# EAGLE design wiringshield1 (EAGLE 5.11)
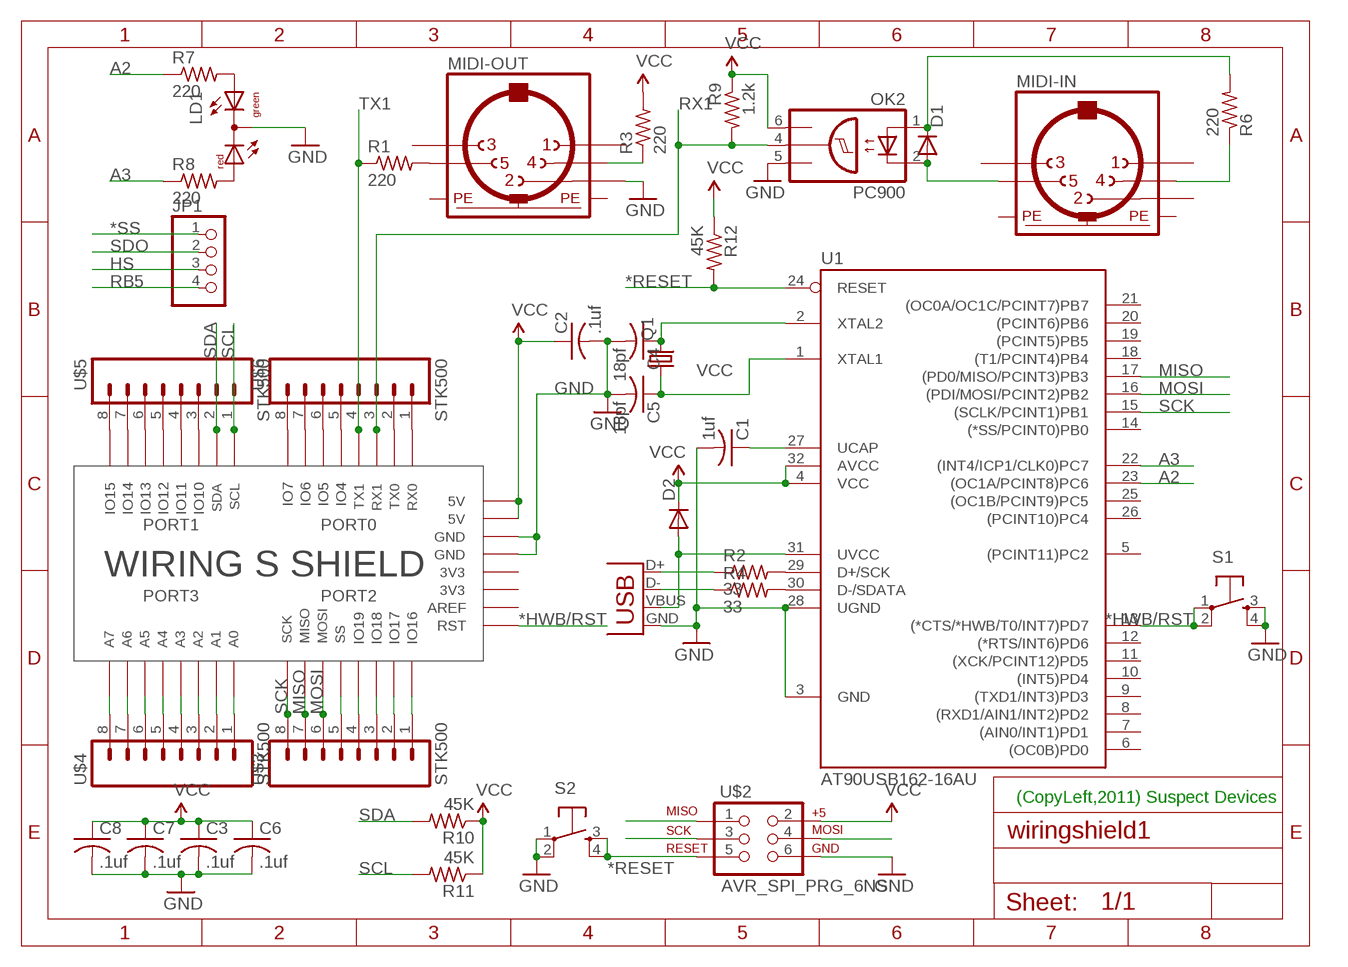
[diagram p0: schematic, sheet 1]

## Parts
C1  1uf  C-USC0603  [C0603]
C2  .1uf  C-USC0603  [C0603]
C3  .1uf  C-USC0603  [C0603]
C4  18pf  C-USC0603  [C0603]
C5  18pf  C-USC0603  [C0603]
C6  .1uf  C-USC0603  [C0603]
C7  .1uf  C-USC0603  [C0603]
C8  .1uf  C-USC0603  [C0603]
D1  DIODEPTH2  [DOIDE-1N4148]
D2  DIODEPTH2  [DOIDE-1N4148]
JP1  PINHD-1X4  [1X04]
LD1  DUOLED-RG-C  [DUOLED-C-5MM]
MIDI-IN  MAB5SH  [MAB5SH]
MIDI-OUT  MAB5SH  [MAB5SH]
OK2  PC900  OPI8013  [DIL06]
Q1  CRYSTALHC49S  [HC49/S]
R1  220  R-US_R0603  [R0603]
R2  33  R-US_R0603  [R0603]
R3  220  R-US_R0603  [R0603]
R4  33  R-US_R0603  [R0603]
R6  220  R-US_R0603  [R0603]
R7  220  R-US_R0603  [R0603]
R8  220  R-US_R0603  [R0603]
R9  1.2k  R-US_R0603  [R0603]
R10  45K  R-US_R0603  [R0603]
R11  45K  R-US_R0603  [R0603]
R12  45K  R-US_R0603  [R0603]
S1  TAC_SWITCHPTH  [TACTILE-PTH]
S2  TAC_SWITCHPTH  [TACTILE-PTH]
U1  AT90USB162-16AU  [VQFP32]
U$1  WIRINGSHIELD  [WIRINGSHIELD]
U$2  AVR_SPI_PRG_6NS  [2X3-NS]
U$3  STK500  [2X5-SHROUDED]
U$4  STK500  [2X5-SHROUDED]
U$5  STK500  [2X5-SHROUDED]
U$6  STK500  [2X5-SHROUDED]
X3  USB-3DPTH  [USB-B-PTH]

## Nets
*HWB/RST: S1.1 S1.2 U1.13((*CTS/*HWB/T0/INT7)PD7) U$1.P$40(RST)
*RESET: R12.2 S2.3 S2.4 U1.24(RESET) U$2.5
*SS: JP1.1
A2: R7.1 U1.23((OC1A/PCINT8)PC6)
A3: R8.1 U1.22((INT4/ICP1/CLK0)PC7)
GND [vcc]: C1.2 C2.2 C3.2 C4.2 C5.2 C6.2 C7.2 C8.2 LD1.C MIDI-OUT.2 OK2.5(GND) S1.3 S1.4 S2.1 S2.2 U1.3(GND) U1.28(UGND) U$1.P$35(GND) U$1.P$36(GND) U$2.6 X3.GND
HS: JP1.3
MISO: U1.17((PD0/MISO/PCINT3)PB3) U$1.P$23(IO22) U$2.1 U$3.7
MOSI: U1.16((PDI/MOSI/PCINT2)PB2) U$1.P$22(IO21) U$2.4 U$3.6
N$1: MIDI-OUT.5 R1.2
N$2: MIDI-OUT.4 R3.1
N$3: C1.1 U1.27(UCAP)
N$4: U$1.P$17(IO16) U$3.1
N$5: U$1.P$18(IO17) U$3.2
N$6: LD1.AX(AG) R7.2
N$7: R2.1 X3.D+
N$8: R4.1 X3.D-
N$9: D2.A U1.31(UVCC) X3.VBUS
N$10: D1.C OK2.1(A) R6.2
N$11: U$1.P$19(IO18) U$3.3
N$12: U$1.P$20(IO19) U$3.4
N$13: U$1.P$21(IO20) U$3.5
N$14: C4.1 Q1.2 U1.2(XTAL2)
N$16: MIDI-IN.4 R6.1
N$17: D1.A MIDI-IN.5 OK2.2(C)
N$18: C5.1 Q1.1 U1.1(XTAL1)
N$22: U$1.P$25(IO24) U$4.1
N$23: U$1.P$26(IO25) U$4.2
N$24: U$1.P$27(IO26) U$4.3
N$25: U$1.P$28(IO27) U$4.4
N$26: U$1.P$29(IO28) U$4.5
N$27: U$1.P$30(IO29) U$4.6
N$28: U$1.P$31(IO30) U$4.7
N$29: U$1.P$32(IO31) U$4.8
N$30: LD1.AR R8.2
N$31: U$1.P$11(IO10) U$5.3
N$32: U$1.P$12(IO11) U$5.4
N$33: U$1.P$13(IO12) U$5.5
N$34: U$1.P$14(IO13) U$5.6
N$35: U$1.P$15(IO14) U$5.7
N$36: U$1.P$16(IO15) U$5.8
N$37: U$1.P$1(IO0) U$6.1
N$38: U$1.P$2(IO1) U$6.2
N$39: U$1.P$5(IO4) U$6.5
N$40: U$1.P$6(IO5) U$6.6
N$41: U$1.P$7(IO6) U$6.7
N$42: U$1.P$8(IO7) U$6.8
N$45: R2.2 U1.29(D+/SCK)
N$47: R4.2 U1.30(D-/SDATA)
RB5: JP1.4
RX1: OK2.4(OUT) R9.2 U$1.P$3(IO2) U$6.3
SCK: U1.15((SCLK/PCINT1)PB1) U$1.P$24(IO23) U$2.3 U$3.8
SCL: R11.2 U$1.P$9(IO8) U$5.1
SDA: R10.2 U$1.P$10(IO9) U$5.2
SDO: JP1.2
TX1: R1.1 U$1.P$4(IO3) U$6.4
VCC: C2.1 C3.1 C6.1 C7.1 C8.1 D2.C OK2.6(VCC) R3.2 R9.1 R10.1 R11.1 R12.1 U1.4(VCC) U1.32(AVCC) U$1.P$33(5V) U$1.P$34(5V) U$2.2
Unconnected: MIDI-IN.1 MIDI-IN.2 MIDI-IN.3 MIDI-IN.PE MIDI-IN.PE@(PE) MIDI-OUT.1 MIDI-OUT.3 MIDI-OUT.PE MIDI-OUT.PE@(PE) U1.5((PCINT11)PC2) U1.6((OC0B)PD0) U1.7((AIN0/INT1)PD1) U1.8((RXD1/AIN1/INT2)PD2) U1.9((TXD1/INT3)PD3) U1.10((INT5)PD4) U1.11((XCK/PCINT12)PD5) U1.12((*RTS/INT6)PD6) U1.14((*SS/PCINT0)PB0) U1.18((T1/PCINT4)PB4) U1.19((PCINT5)PB5) U1.20((PCINT6)PB6) U1.21((OC0A/OC1C/PCINT7)PB7) U1.25((OC1B/PCINT9)PC5) U1.26((PCINT10)PC4) U$1.P$39(AREF)

## Notes on the sheet
- (CopyLeft,2011) Suspect Devices

## Power pins joined to a net without a drawn wire
3V3: U$1.P$37(3V3) U$1.P$38(3V3)
GND: U$3.9(GND) U$4.9(GND) U$5.9(GND) U$6.9(GND)
VCC: U$3.10(VCC) U$4.10(VCC) U$5.10(VCC) U$6.10(VCC)

## Library data of the parts
C1-C8 = rcl:C-US: CAPACITOR, American symbol
D1 D2 = 3d:DIODE: Diode These are standard reverse protection diodes and small signal diodes. SMA package can handle up to about 1A. SOD-323 can handle about 200mA. What the SOD-323 package when ordering, there are some mfgs out there that are 5-pin packages.
JP1 = 3d2011:PINHD-1X4: PIN HEADER
LD1 = led:DUOLED-RG-C: DUO LED 2 colors (red/green), 5 mm, round, common Cathode www.ligitek.com or other producers.
MIDI-IN MIDI-OUT = 3d2010:MAB5SH: Female CONNECTOR 5 pins 90 deg. with shield, horizontal (DIN 41524)
OK2 = optocoupler:OPI8013: OPTO COUPLER; OC_FARNELL: unknown; OC_NEWARK: unknown
Q1 = crystal:CRYSTAL: CRYSTAL; OC_FARNELL: 1667008; OC_NEWARK: unknown
R1 R3 R7 R8 R10-R12 = resistor:R-US_: RESISTOR, American symbol
R2 R4 R6 R9 = rcl:R-US_: RESISTOR, American symbol
S1 S2 = 3d2011:TAC_SWITCH: Momentary Switch Button commonly used for reset or general input. Spark Fun Electronics SKU : COM-00097
U1 = at90usb:AT90USB162
U$1 = 3d2011:WIRINGSHIELD: Wiring S Shield
U$2 = 3d2011:AVR_SPI_PRG_6: AVR ISP 6 Pin This is the reduced ISP connector for AVR programming. Common on Arduino. This footprint will take up less PCB space and can be used with a 10-pin to 6-pin adapter such as SKU: BOB-08508
U$3-U$6 = 3d2011:STK500
X3 = 3d2010:USB-3D: USB Connectors USB-B-PTH is fully proven SKU : PRT-00139 USB-miniB is fully proven SKU : PRT-00587 USB-A-PCB is untested. USB-A-H is throughly reviewed, but untested. Spark Fun Electronics SKU : PRT-00437 USB-B-SMT is throughly reviewed, but untested. Needs silkscreen touching up. USB-A-S has not been used/tested USB-MB-H has not been used/tested

## Net classes
0 default: width 0.203 mm
1 vcc: width 0.254 mm

## Board
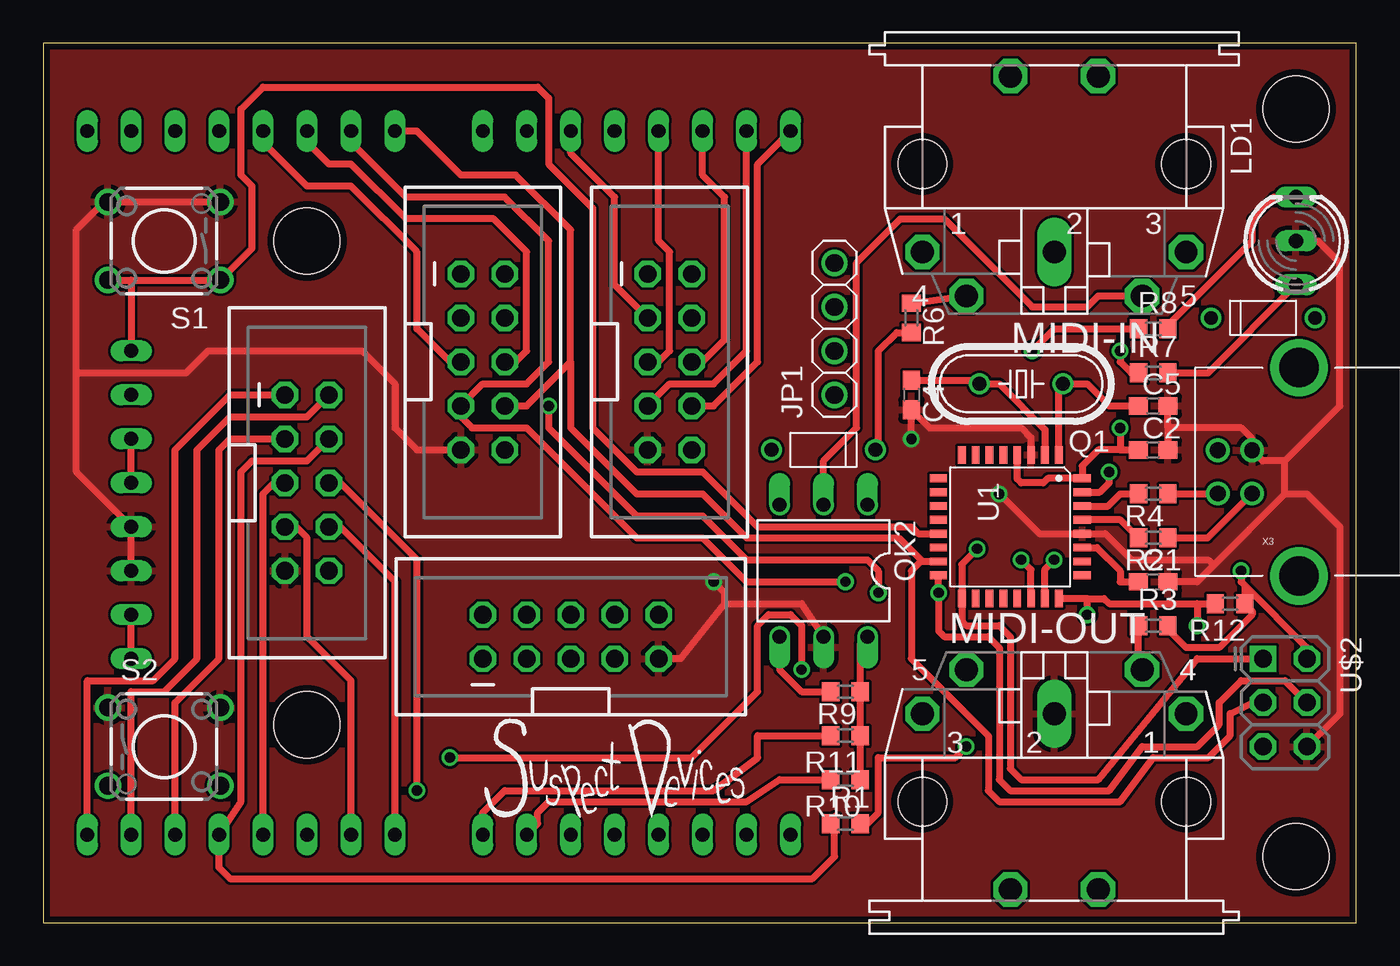
[diagram p1: board, top side]
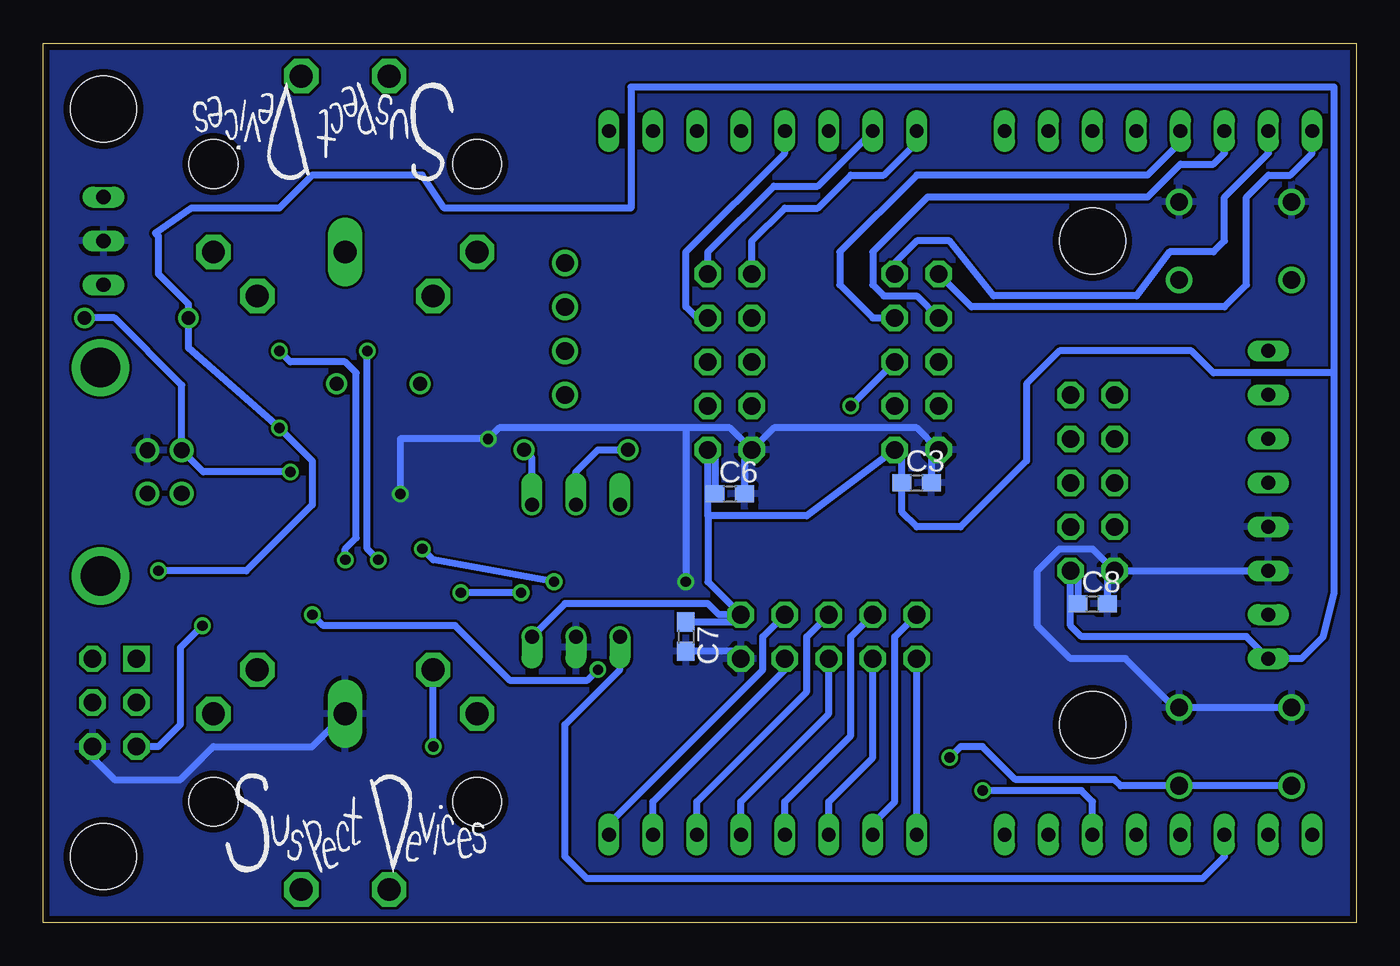
[diagram p2: board, bottom side, seen from below]

Size 75.87 x 50.79 mm. Coordinates in mm from the lower left corner, seen from the top.
Outline: 0,0 75.87,0 75.87,50.79 0,50.79 0,0
Copper layers (1*16): Top 0.0356mm / dielectric 1.5011mm / Bottom 0.0356mm
Design rules "LaenPCBOrder": minimum track width 6mil, minimum drill 13mil, track to track 6mil, track to pad 6mil, pad to pad 6mil, via to via 6mil, smd to smd 6mil, copper to edge 15mil, drill to drill 6mil, minimum pad ring 7mil, minimum via ring 7mil, stop-mask expansion 4mil, vias tented up to drill 0mil, thermal gap 10mil

### Footprints (pad centres in the part's own frame; a part is rotated, then mirrored left to right if it is on the bottom)
C0603 = smd 1.1 x 1: 1 -0.85,0; 2 0.85,0
DOIDE-1N4148 = drill 0.8 round: A 3,0; C -3,0
1X04 = drill 1.016 round: 1 -3.81,0; 2 -1.27,0; 3 1.27,0; 4 3.81,0
DUOLED-C-5MM = drill 0.813 long: AR 2.54,0; AX -2.54,0; C 0,0
MAB5SH = drill 1.321 octagon: 1 7.62,5.08; 3 -7.62,5.08; 4 5.08,7.62; 5 -5.08,7.62; PE -2.54,-5.08; PE@ 2.54,-5.08 | drill 1.321 long: 2 0,5.08 | hole 2.794: 7.62,0; -7.62,0
DIL06 = drill 0.813 offset: 1 -2.54,-3.81; 2 0,-3.81; 3 2.54,-3.81; 4 2.54,3.81; 5 0,3.81; 6 -2.54,3.81
HC49/S = drill 0.813 round: 1 -2.413,0; 2 2.413,0
R0603 = smd 1 x 1.1: 1 -0.85,0; 2 0.85,0
TACTILE-PTH = drill 1.016 round: 1 -3.251,2.261; 2 3.251,2.261; 3 -3.251,-2.261; 4 3.251,-2.261
VQFP32 = smd 1 x 0.45: 1 -4.15,2.8; 2 -4.15,2; 3 -4.15,1.2; 4 -4.15,0.4; 5 -4.15,-0.4; 6 -4.15,-1.2; 7 -4.15,-2; 8 -4.15,-2.8; 17 4.15,-2.8; 18 4.15,-2; 19 4.15,-1.2; 20 4.15,-0.4; 21 4.15,0.4; 22 4.15,1.2; 23 4.15,2; 24 4.15,2.8 | smd 0.45 x 1: 9 -2.8,-4.15; 10 -2,-4.15; 11 -1.2,-4.15; 12 -0.4,-4.15; 13 0.4,-4.15; 14 1.2,-4.15; 15 2,-4.15; 16 2.8,-4.15; 25 2.8,4.15; 26 2,4.15; 27 1.2,4.15; 28 0.4,4.15; 29 -0.4,4.15; 30 -1.2,4.15; 31 -2,4.15; 32 -2.8,4.15
WIRINGSHIELD = drill 0.8 long: P$1 2.54,5.08; P$2 5.08,5.08; P$3 7.62,5.08; P$4 10.16,5.08; P$5 12.7,5.08; P$6 15.24,5.08; P$7 17.78,5.08; P$8 20.32,5.08; P$9 25.4,5.08; P$10 27.94,5.08; P$11 30.48,5.08; P$12 33.02,5.08; P$13 35.56,5.08; P$14 38.1,5.08; P$15 40.64,5.08; P$16 43.18,5.08; P$17 2.54,45.72; P$18 5.08,45.72; P$19 7.62,45.72; P$20 10.16,45.72; P$21 12.7,45.72; P$22 15.24,45.72; P$23 17.78,45.72; P$24 20.32,45.72; P$25 25.4,45.72; P$26 27.94,45.72; P$27 30.48,45.72; P$28 33.02,45.72; P$29 35.56,45.72; P$30 38.1,45.72; P$31 40.64,45.72; P$32 43.18,45.72; P$33 5.08,15.24; P$34 5.08,17.78; P$35 5.08,20.32; P$36 5.08,22.86; P$37 5.08,25.4; P$38 5.08,27.94; P$39 5.08,30.48; P$40 5.08,33.02 | hole 3.81: 15.24,11.43; 15.24,39.37; 72.39,46.99; 72.39,3.81
2X3-NS = drill 1.016 square: 1 -2.54,-1.27 | drill 1.016 octagon: 2 -2.54,1.27; 3 0,-1.27; 4 0,1.27; 5 2.54,-1.27; 6 2.54,1.27
2X5-SHROUDED = drill 1.016 octagon: 1 -1.27,5.08; 2 1.27,5.08; 3 -1.27,2.54; 4 1.27,2.54; 5 -1.27,0; 6 1.27,0; 7 -1.27,-2.54; 8 1.27,-2.54; 9 -1.27,-5.08; 10 1.27,-5.08
USB-B-PTH = drill 0.914 round: D+ 0,1.25; D- 1.981,1.25; GND 0,-1.25; VBUS 1.981,-1.25 | drill 2.286 round: P$1 -2.718,-6.02; P$2 -2.718,6.02

### Placement (x,y rotation side)
C1  64.14,19.68 0 top
C2  64.14,27.3 0 top
C3  25.4,25.4 0 bottom
C4  50.16,30.48 270 top
C5  64.14,29.84 0 top
C6  36.2,24.77 0 bottom
C7  38.73,16.51 270 bottom
C8  15.24,18.41 0 bottom
D1  45.09,27.3 180 top
D2  70.48,34.92 0 top
JP1  45.72,34.29 90 top
LD1  72.39,39.37 90 top
MIDI-IN  58.42,43.81 180 top
MIDI-OUT  58.42,6.99 0 top
OK2  45.09,20.32 180 top
Q1  56.52,31.11 180 top
R1  46.35,5.71 0 top
R2  64.14,22.23 180 top
R3  64.14,17.14 0 top
R4  64.14,24.77 180 top
R6  50.16,34.92 270 top
R7  64.14,31.75 0 top
R8  64.14,34.29 0 top
R9  46.35,13.34 180 top
R10  46.35,8.26 180 top
R11  46.35,10.79 180 top
R12  68.58,18.41 180 top
S1  6.99,39.37 180 top
S2  6.99,10.16 0 top
U1  55.88,22.86 270 top
U$1  0,0 0 top
U$2  71.75,12.7 270 top
U$3  25.4,32.38 0 top
U$4  36.2,32.38 0 top
U$5  30.48,16.51 90 top
U$6  15.24,25.4 0 top
U$7  [SUSDEVLOGOSM]  25.4,6.35 0 top
U$8  [SUSDEVLOGOSM]  65.41,3.17 0 bottom
U$9  [SUSDEVLOGOSM]  52.07,48.26 180 bottom
X3  69.85,26.04 180 top

### Tracks (layer width: path | path; a pad name or v marks a point on that pad's centre or on a via)
3V3
  Top 0.406: U$1.P$37 U$1.P$38
*HWB/RST
  Top 0.406: 5.08,37.11 U$1.P$40 | U1.13 50.56,22.46 50.16,22.86 41.27,22.86 38.1,26.04 34.29,26.04 31.75,28.57 31.75,41.27 29.21,43.81 29.21,47.62 28.57,48.26 12.7,48.26 11.43,46.99 11.43,43.18 12.06,42.55 12.06,38.94 S1.1 5.08,37.11 | S1.2 5.08,37.11
*RESET  (via drill 0.6)
  Top 0.406: v23.5,9.53 37.47,9.53 41.27,13.34 41.27,17.14 41.91,17.78 43.18,17.78 43.81,17.14 v43.81,14.61 | 60.33,18.71 U1.24 | 60.33,18.71 61.3,18.71 61.59,18.41 66.67,18.41 | 66.67,18.41 R12.2 | 66.67,18.41 v66.67,17.14 | v60.33,17.78 60.33,18.71
  Bottom 0.406: S2.3 S2.4 13.61,7.9 13.97,8.26 19.68,8.26 21.59,10.16 22.86,10.16 v23.5,9.53 | U$2.5 69.22,10.16 67.94,11.43 67.94,15.88 v66.67,17.14 | v43.81,14.61 44.45,13.97 48.9,13.97 52.07,17.14 59.69,17.14 v60.33,17.78
A2  (via drill 0.6)
  Top 0.406: U1.23 57.88,20.41 v58.42,20.95 | v62.23,33.02 62.23,32.38 62.87,31.75 R7.1
  Bottom 0.406: v58.42,20.95 58.42,21.59 57.78,22.23 57.78,31.75 58.42,32.38 61.59,32.38 v62.23,33.02
A3  (via drill 0.6)
  Top 0.406: R8.1 58.42,34.29 v57.15,33.02 | U1.22 57.08,20.39 v56.52,20.95
  Bottom 0.406: v57.15,33.02 57.15,21.59 v56.52,20.95
GND  (via drill 0.6)
  Top 0.406: 73.66,39.37 74.93,38.1 74.93,29.84 71.75,26.67 | S1.3 S1.4 3.53,41.63 1.91,40.01 1.91,31.75 | 1.91,31.75 1.91,26.04 U$1.P$36 U$1.P$35 | U$3.9 21.59,27.3 20.32,28.57 20.32,31.11 18.41,33.02 9.53,33.02 8.26,31.75 1.91,31.75 | 39.37,18.41 36.83,15.24 U$5.9 | 39.37,18.41 43.81,18.41 OK2.5 | C1.2 66.67,19.68 67.63,20.64 | 71.75,24.77 71.75,26.67 | 71.75,26.67 70.47,26.67 X3.GND 69.85,27.94 69.22,28.57 64.98,28.57 | 67.63,20.64 67.31,20.95 62.87,20.95 61.36,22.46 U1.28 57.55,22.46 v55.24,24.77 | 64.98,28.57 C2.2 | 64.98,28.57 C5.2 | U1.3 57.08,28.01 56.52,28.57 51.22,28.57 C4.2 v50.16,27.94 | 67.63,20.64 71.75,24.77 | 71.75,24.77 73.03,24.77 74.93,22.86 74.93,12.06 U$2.6 | 39.37,18.41 39.37,19.05 v38.73,19.68
  Bottom 0.406: U$6.9 U$1.P$35 | U$4.9 33.66,28.57 25.4,28.57 U$3.9 24.55,26.89 C3.2 | U$4.9 36.2,28.57 38.73,28.57 | C6.2 35.34,26.89 U$4.9 | C7.2 35.98,15.66 U$5.9 | C8.2 14.39,19.9 U$6.9 | S2.1 S2.2 10.52,12.42 13.34,15.24 16.51,15.24 18.41,17.14 18.41,20.32 17.14,21.59 15.24,21.59 U$6.9 | U$2.6 73.03,9.53 71.75,8.26 67.94,8.26 66.04,10.16 60.33,10.16 MIDI-OUT.2 | v55.24,24.77 55.24,27.94 v50.16,27.94 49.53,28.57 38.73,28.57 | 38.73,28.57 v38.73,19.68
  pour Top: 0,0 76.2,0 76.2,50.8 -1.27,50.8
  pour Bottom: 0,0 76.2,0 76.2,50.8 -1.27,50.8
MISO  (via drill 0.6)
  Top 0.406: U$2.1 66.67,15.24 60.96,8.26 56.52,8.26 55.88,8.89 55.88,16.51 55.24,17.14 53.34,17.14 53.08,17.41 U1.17 53.08,20.7 v53.98,21.59 | U$1.P$23 17.78,45.09 20.95,41.91 26.67,41.91 29.21,39.37 29.21,32.38 27.94,31.11 25.4,31.11 U$3.7 24.13,29.21 24.77,28.57 27.94,28.57 34.29,22.23 38.1,22.23 40.64,19.68 v46.35,19.68
  Bottom 0.406: v46.35,19.68 53.34,20.95 v53.98,21.59
MOSI  (via drill 0.6)
  Top 0.406: U$2.4 71.75,13.97 69.22,13.97 67.94,12.7 67.94,11.43 66.67,10.16 63.5,10.16 61.59,7.62 55.88,7.62 55.24,8.26 55.24,15.88 54.61,16.51 52.07,16.51 51.73,16.85 v51.73,19.05 U1.16 | U$1.P$22 15.24,45.09 16.51,43.81 17.78,43.81 20.95,40.64 26.04,40.64 27.94,38.73 27.94,33.02 27.3,32.38 U$3.6 | v29.21,29.84 29.21,28.57 34.29,23.5 38.1,23.5 40.64,20.95 47.62,20.95 48.26,20.32 v48.26,19.05
  Bottom 0.406: U$3.6 v29.21,29.84 | v48.26,19.05 v51.73,19.05
N$1  (via drill 0.6)
  Top 0.406: R1.2 47.62,5.71 48.26,6.35 48.26,9.53 52.7,9.53 v53.34,10.16
  Bottom 0.406: v53.34,10.16 MIDI-OUT.5
N$2
  Top 0.406: R3.1 63.28,14.82 MIDI-OUT.4
N$3
  Top 0.406: U1.27 60.89,21.66 62.23,20.32 62.23,19.68 C1.1
N$4
  Bottom 0.406: U$1.P$17 2.54,44.45 3.81,43.18 5.08,43.18 6.35,41.91 6.35,36.83 7.62,35.56 22.23,35.56 U$3.1
N$5
  Bottom 0.406: U$1.P$18 5.08,44.45 7.62,41.91 7.62,39.37 8.26,38.73 10.79,38.73 12.7,36.2 20.95,36.2 23.5,39.37 25.4,39.37 26.67,38.1 U$3.2
N$6
  Top 0.406: R7.2 67.31,31.75 LD1.AX
N$7
  Top 0.406: R2.1 67.29,22.23 X3.D+
N$8
  Top 0.406: R4.1 67.85,24.77 X3.D-
N$9  (via drill 0.6)
  Top 0.406: U1.31 61.05,24.86 61.59,25.4 v61.59,26.04
  Bottom 0.406: v61.59,26.04 66.62,26.04 X3.VBUS 67.87,31.04 71.75,34.92 D2.A
N$10
  Top 0.406: R6.2 49.31,34.08 48.26,33.02 48.26,27.48 D1.C
  Bottom 0.406: OK2.1 47.62,26.84 D1.C
N$11
  Bottom 0.406: U$1.P$19 7.62,44.45 8.26,43.81 10.16,43.81 12.06,41.91 24.77,41.91 27.94,38.73 27.94,36.83 27.3,36.2 25.4,36.2 U$3.3
N$12
  Bottom 0.406: U$1.P$20 10.16,45.09 12.06,43.18 25.4,43.18 29.84,38.73 29.84,36.83 27.94,34.92 U$3.4
N$13
  Top 0.406: U$1.P$21 12.7,45.09 15.24,42.55 17.78,42.55 21.59,38.73 21.59,34.29 23.5,32.38 U$3.5
N$14
  Top 0.406: U1.2 57.88,28.48 55.24,31.11 Q1.2 53.89,31.33 C4.1
N$16
  Top 0.406: R6.1 MIDI-IN.4
N$17
  Top 0.406: OK2.2 45.09,26.67 46.99,28.57 46.99,38.1 49.53,40.64 52.07,40.64 57.15,35.56 60.33,35.56 60.96,36.2 MIDI-IN.5
  Bottom 0.406: D1.A 43.81,27.3 45.09,26.04 OK2.2
N$18
  Top 0.406: U1.1 58.68,30.87 Q1.1 60.33,31.11 61.59,29.84 C5.1
N$22
  Bottom 0.406: U$1.P$25 25.4,45.09 27.3,43.18 29.21,43.18 31.11,41.27 33.02,41.27 34.92,39.37 U$4.1
N$23
  Bottom 0.406: U$1.P$26 31.11,42.55 33.66,42.55 37.47,38.73 U$4.2
N$24
  Top 0.406: U$1.P$27 30.48,44.45 33.02,41.91 33.02,36.83 U$4.3
N$25
  Bottom 0.406: U$1.P$28 33.02,44.45 38.73,38.73 38.73,35.56 38.1,34.92 U$4.4
N$26
  Top 0.406: U$1.P$29 35.56,39.37 36.2,38.73 36.2,33.02 35.56,32.38 U$4.5
N$27
  Top 0.406: U$1.P$30 38.1,43.18 39.37,41.91 39.37,33.66 38.1,32.38 U$4.6
N$28
  Top 0.406: U$4.7 36.2,31.11 38.73,31.11 40.64,33.02 U$1.P$31
N$29
  Top 0.406: U$4.8 38.73,29.84 41.27,32.38 41.27,43.81 U$1.P$32
N$30
  Top 0.406: LD1.AR 71.12,41.91 69.85,40.64 69.85,39.37 64.98,34.51 R8.2
N$31
  Bottom 0.406: U$5.3 27.94,9.53 30.48,6.99 U$1.P$11
N$32
  Bottom 0.406: U$5.4 29.21,16.51 29.21,10.79 33.02,6.99 U$1.P$12
N$33
  Bottom 0.406: U$5.5 30.48,12.06 35.56,6.99 U$1.P$13
N$34
  Bottom 0.406: U$5.6 31.75,16.51 31.75,13.34 38.1,6.99 U$1.P$14
N$35
  Bottom 0.406: U$5.7 33.02,14.61 40.64,6.99 U$1.P$15
N$36
  Bottom 0.406: U$5.8 34.29,16.51 34.29,14.61 43.18,5.71 U$1.P$16
N$37
  Top 0.406: U$6.1 10.79,30.48 7.62,27.3 7.62,15.24 6.35,13.97 2.54,13.97 U$1.P$1
N$38
  Top 0.406: U$6.2 15.24,29.21 10.79,29.21 8.89,27.3 8.89,15.24 6.99,13.34 5.08,13.34 U$1.P$2
N$39
  Top 0.406: U$6.5 13.34,25.4 12.7,24.77 U$1.P$5
N$40  (via drill 0.6)
  Top 0.406: U$6.6 17.14,25.4 21.59,20.95 v21.59,7.62
  Bottom 0.406: v21.59,7.62 15.88,7.62 15.24,6.99 U$1.P$6
N$41
  Top 0.406: U$6.7 14.61,22.86 15.24,22.23 15.24,16.51 17.78,13.97 U$1.P$7
N$42
  Top 0.406: U$6.8 17.14,22.86 20.32,19.68 U$1.P$8
N$45
  Top 0.406: U1.29 62.25,23.26 R2.2
N$47
  Top 0.406: U1.30 61.52,24.06 62.23,24.77 R4.2
RX1
  Top 0.406: U$6.3 10.79,27.94 10.16,27.3 10.16,15.24 7.62,12.7 U$1.P$3 | R9.2 43.81,13.34 42.55,14.61 OK2.4
  Bottom 0.406: U$1.P$3 7.62,3.81 8.89,2.54 44.45,2.54 45.72,3.81 45.72,11.43 42.55,14.61 OK2.4
SCK
  Top 0.406: 50.8,20.86 50.7,20.86 50.16,20.32 50.16,15.24 54.61,10.79 54.61,7.62 55.24,6.99 62.23,6.99 64.14,9.53 67.31,9.53 68.58,10.79 68.58,12.06 69.85,12.7 U$2.3 | 50.8,20.86 U1.15 | U$1.P$24 21.59,45.72 24.13,43.18 27.3,43.18 30.48,40.01 30.48,32.38 | 30.48,32.38 27.94,29.84 U$3.8 | 30.48,32.38 30.48,28.57 34.29,24.77 38.1,24.77 40.64,22.23 49.44,22.23 50.8,20.86
SCL
  Top 0.406: R11.2 41.27,10.79 41.27,9.53 38.73,7.62 26.67,7.62 25.4,6.35 U$1.P$9
  Bottom 0.406: U$1.P$9 U$5.1
SDA
  Top 0.406: U$1.P$10 28.57,5.71 28.57,6.35 29.21,6.99 40.64,6.99 42.55,8.26 R10.2
  Bottom 0.406: U$5.2 26.67,16.51 26.67,6.99 27.94,5.71 U$1.P$10
TX1
  Top 0.406: R1.1 45.72,6.13 45.72,3.81 44.45,2.54 10.79,2.54 10.16,3.17 U$1.P$4 11.43,6.99 11.43,26.04 12.06,26.67 15.24,26.67 U$6.4
VCC  (via drill 0.6)
  Top 0.406: R10.1 R11.1 R9.1 47.2,16.09 OK2.6 | U$1.P$33 U$1.P$34 | 62.23,27.3 60.96,27.3 60.03,26.38 U1.32 58.05,25.66 57.78,25.4 56.52,25.4 56.28,25.64 U1.4 | 62.23,27.3 C2.1 | U$2.2 73.03,15.88 69.43,19.47 | R3.2 64.98,16.93 66.04,15.88 67.94,15.88 69.85,17.78 69.85,18 R12.1 69.43,19.47 | v62.23,28.57 62.23,27.3 | v69.22,20.32 69.22,19.68 69.43,19.47
  Bottom 0.406: 1.27,31.75 1.27,19.05 1.91,16.51 3.17,15.24 U$1.P$33 6.35,16.51 15.88,16.51 16.51,17.14 U$6.10 16.09,19.9 C8.1 | 1.27,31.75 1.27,48.26 41.91,48.26 41.91,41.27 52.7,41.27 53.98,43.18 60.33,43.18 62.23,41.27 67.31,41.27 69.39,39.83 69.22,39.66 69.22,37.47 67.48,35.73 D2.C 67.48,33.2 v62.23,28.57 60.33,26.67 60.33,24.13 64.14,20.32 v69.22,20.32 | 37.47,23.5 31.75,23.5 U$3.10 26.25,26.89 C3.1 26.25,23.71 25.4,22.86 22.86,22.86 19.05,26.67 19.05,31.11 17.14,33.02 9.53,33.02 8.26,31.75 1.27,31.75 | 37.47,23.5 U$4.10 37.05,26.89 C6.1 | C7.1 35.98,17.36 U$5.10 | U$5.10 36.83,17.78 37.47,18.41 45.72,18.41 OK2.6 | 37.47,23.5 37.47,19.68 U$5.10